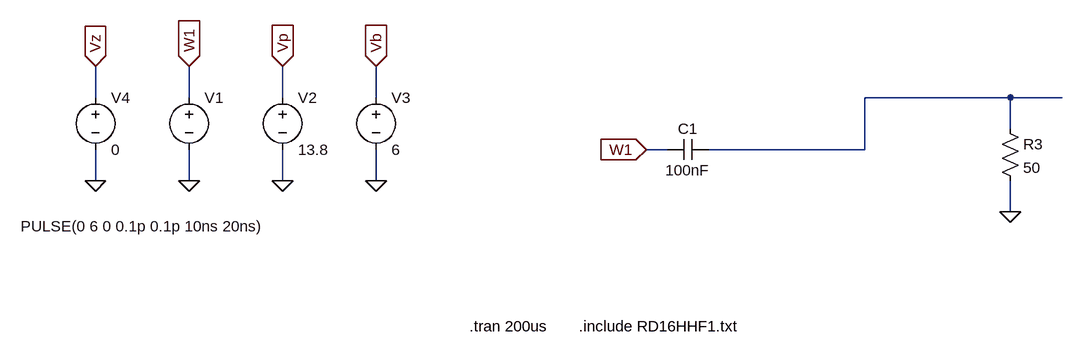
[diagram p0: schematic Driver-Simulation.asc]
Driver-Simulation.asc, the LTspice schematic file:
Version 4
SHEET 1 1044 680
WIRE -736 -16 -736 -64
WIRE -592 -16 -592 -64
WIRE -448 -16 -448 -64
WIRE -304 -16 -304 -64
WIRE 672 -16 448 -16
WIRE 752 -16 672 -16
WIRE 672 32 672 -16
WIRE 144 64 112 64
WIRE 448 64 448 -16
WIRE 448 64 208 64
WIRE -736 112 -736 64
WIRE -592 112 -592 64
WIRE -448 112 -448 64
WIRE -304 112 -304 64
WIRE 672 160 672 112
FLAG 112 64 W1
IOPIN 112 64 In
FLAG -592 112 0
FLAG -448 112 0
FLAG -592 -64 W1
IOPIN -592 -64 In
FLAG -448 -64 Vp
IOPIN -448 -64 In
FLAG -304 112 0
FLAG -304 -64 Vb
IOPIN -304 -64 In
FLAG -736 -64 Vz
IOPIN -736 -64 In
FLAG -736 112 0
FLAG 672 160 0
SYMBOL voltage -592 -32 R0
WINDOW 3 -259 214 Left 2
WINDOW 123 0 0 Left 0
WINDOW 39 0 0 Left 0
SYMATTR Value PULSE(0 6 0 0.1p 0.1p 10ns 20ns)
SYMATTR InstName V1
SYMBOL voltage -448 -32 R0
WINDOW 123 0 0 Left 0
WINDOW 39 0 0 Left 0
SYMATTR InstName V2
SYMATTR Value 13.8
SYMBOL voltage -304 -32 R0
WINDOW 123 0 0 Left 0
WINDOW 39 0 0 Left 0
SYMATTR InstName V3
SYMATTR Value 6
SYMBOL cap 208 48 R90
WINDOW 0 0 32 VBottom 2
WINDOW 3 32 32 VTop 2
SYMATTR InstName C1
SYMATTR Value 100nF
SYMBOL voltage -736 -32 R0
WINDOW 123 0 0 Left 0
WINDOW 39 0 0 Left 0
SYMATTR InstName V4
SYMATTR Value 0
SYMBOL res 656 16 R0
SYMATTR InstName R3
SYMATTR Value 50
TEXT -160 336 Left 2 !.tran 200us
TEXT 8 336 Left 2 !.include RD16HHF1.txt

The netlist it stands for:
* Driver-Simulation.asc
V1 W1 0 PULSE(0 6 0 0.1p 0.1p 10ns 20ns)
V2 Vp 0 13.8
V3 Vb 0 6
C1 N001 W1 100nF
V4 Vz 0 0
R3 N001 0 50
.tran 200us
.include RD16HHF1.txt
.backanno
.end